# Altium project PlacaHalls.PrjPcb
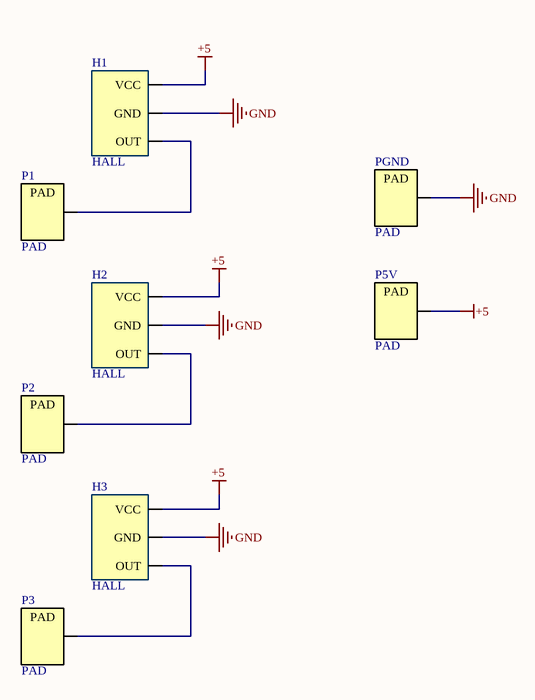
[diagram p0: PlacaHalls.SchDoc]
1 sheet, 8 parts. Net scope: global (net labels, ports and power ports of the same name join across sheets).
Board file: PlacaHalls.PcbDoc

## Sheet PlacaHalls.SchDoc
size A4; SheetNumber: 1; SheetTotal: 1

### Parts
H1  HALL  [Hall_Sensor]
H2  HALL  [Hall_Sensor]
H3  HALL  [Hall_Sensor]
P1  PAD  [PAD]
P2  PAD  [PAD]
P3  PAD  [PAD]
P5V  PAD  [PAD]
PGND  PAD  [PAD]

### Nets
+5: H1.1(VCC) H2.1(VCC) H3.1(VCC) P5V.1(PD)
GND: H1.2(GND) H2.2(GND) H3.2(GND) PGND.1(PD)
NetH1_3: H1.3(OUT) P1.1(PD)
NetH2_3: H2.3(OUT) P2.1(PD)
NetH3_3: H3.3(OUT) P3.1(PD)

### Library data of the parts
H1-H3 = HALL: HALL SENSOR